# EAGLE design MotionSensorModule (EAGLE 7.7.0)
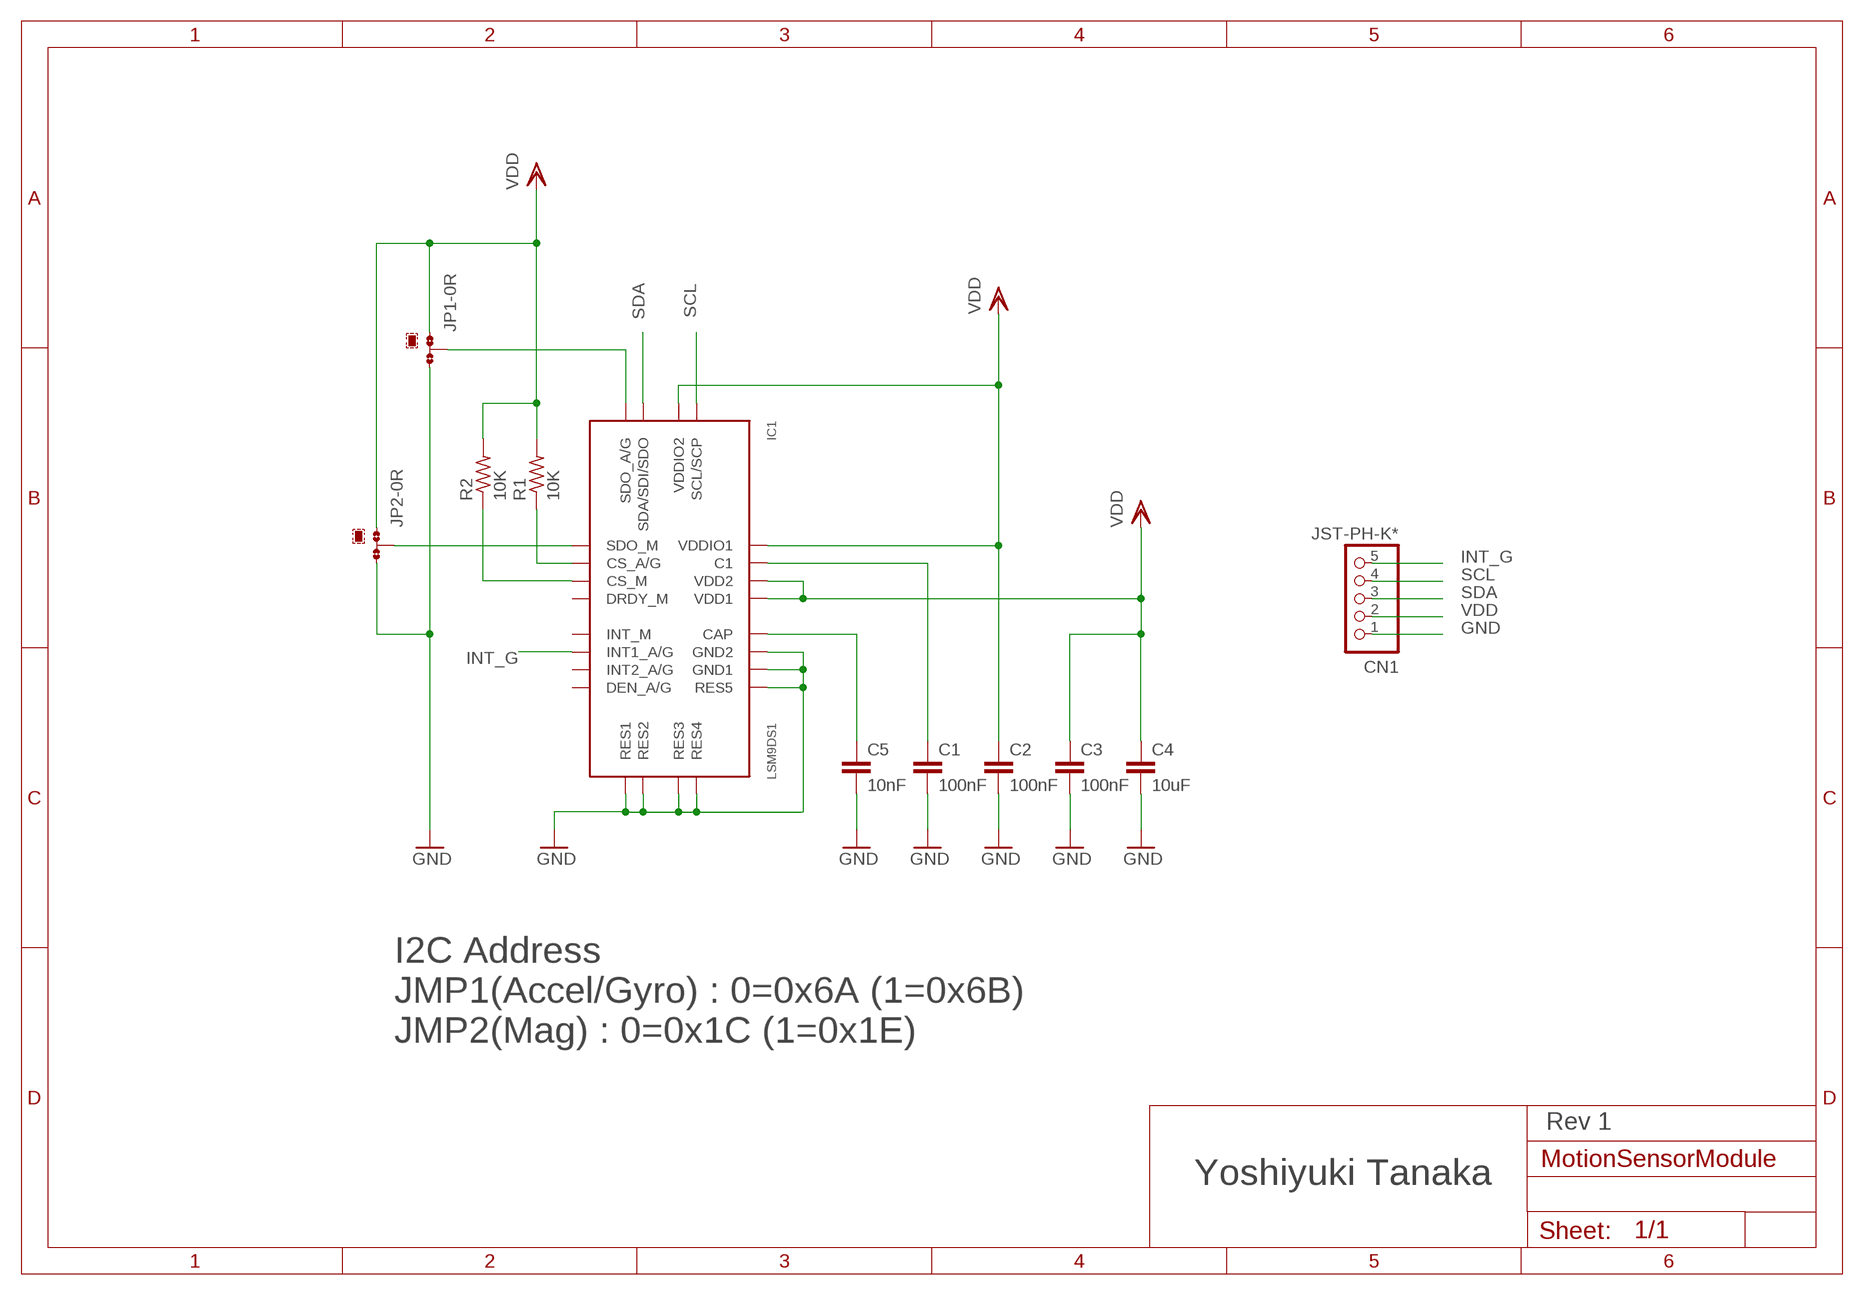
[diagram p0: schematic, sheet 1]

## Parts
C1  100nF  C-EUC0603  [C0603]
C2  100nF  C-EUC0603  [C0603]
C3  100nF  C-EUC0603  [C0603]
C4  10uF  C-EUC0603  [C0603]
C5  10nF  C-EUC0603  [C0603]
CN1  JST-PH-K*  B5B-PH-SM4-TB  [B5B-PH-SM4-TB]
IC1  LSM9DS1  [LGA-24L]
JP1  0R-JUMPB  [B0R-JMP]
JP2  0R-JUMPB  [B0R-JMP]
R1  10K  R-US_R0603  [R0603]
R2  10K  R-US_R0603  [R0603]

## Nets
GND: C1.2 C2.2 C3.2 C4.2 C5.2 CN1.1 IC1.14(RES1) IC1.15(RES2) IC1.16(RES3) IC1.17(RES4) IC1.18(RES5) IC1.19(GND1) IC1.20(GND2) JP1.3 JP2.3
INT_G: CN1.5 IC1.11(INT1_A/G)
N$1: C1.1 IC1.24(C1)
N$2: IC1.8(CS_M) R2.1
N$3: IC1.7(CS_A/G) R1.1
N$4: IC1.5(SDO_A/G) JP1.2
N$6: IC1.6(SDO_M) JP2.2
N$7: C5.1 IC1.21(CAP)
SCL: CN1.4 IC1.2(SCL/SCP)
SDA: CN1.3 IC1.4(SDA/SDI/SDO)
VDD: C2.1 C3.1 C4.1 CN1.2 IC1.1(VDDIO1) IC1.3(VDDIO2) IC1.22(VDD1) IC1.23(VDD2) JP1.1 JP2.1 R1.2 R2.2
Unconnected: IC1.9(DRDY_M) IC1.10(INT_M) IC1.12(INT2_A/G) IC1.13(DEN_A/G)

## Notes on the sheet
- I2C Address
  JMP1(Accel/Gyro) : 0=0x6A (1=0x6B)
  JMP2(Mag) : 0=0x1C (1=0x1E)
- Rev 1
- Yoshiyuki Tanaka

## Library data of the parts
C1-C5 = rcl:C-EU: CAPACITOR, European symbol
CN1 = jst-ph:B5B-PH-*: Wire-to-Board 2.0mm pitch top mount connector Source: http://www.jst-mfg.com/product/pdf/jpn/PH.pdf http://www.jst-mfg.com/product/detail.php?series=199
IC1 = st:LSM9DS1: Mouser 部品番号：511-LSM9DS1TR メーカ部品番号：LSM9DS1TR メーカ:STMicroelectronics 詳細：IMU - 慣性測定ユニット MOTION MEMS CONSUMER
JP1 JP2 = jump-0r-smd:0R-JUMP: SMD 0R 0805 Jumper
R1 R2 = resistor:R-US_: RESISTOR, American symbol

## Board
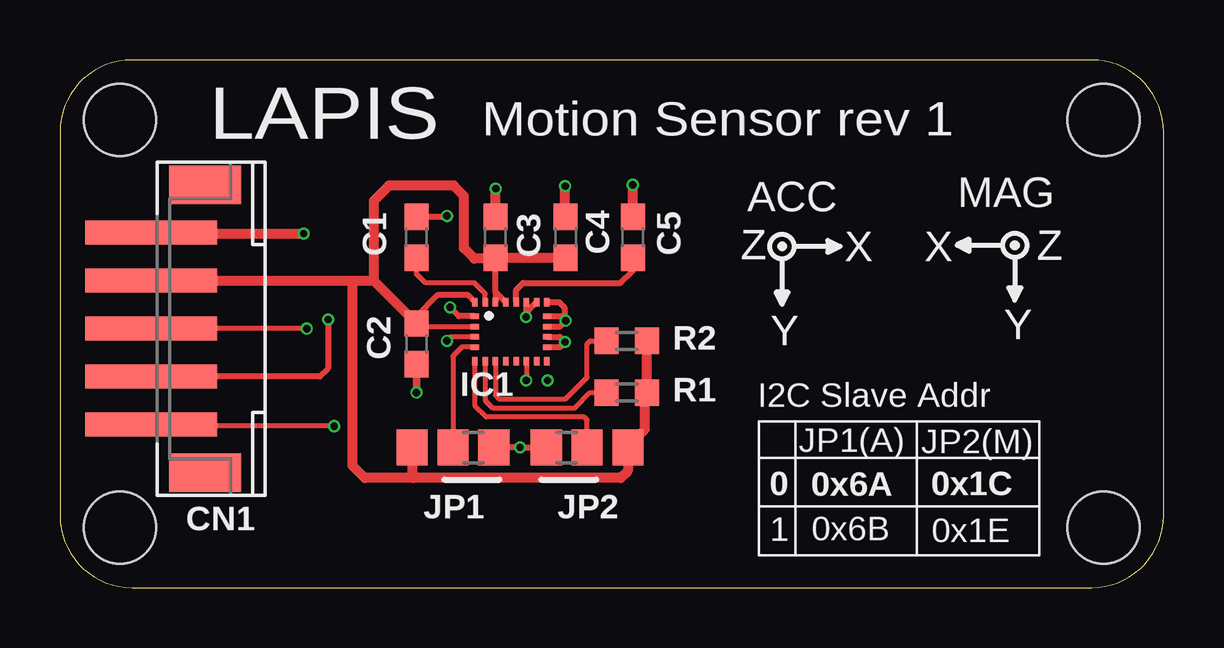
[diagram p1: board, top side]
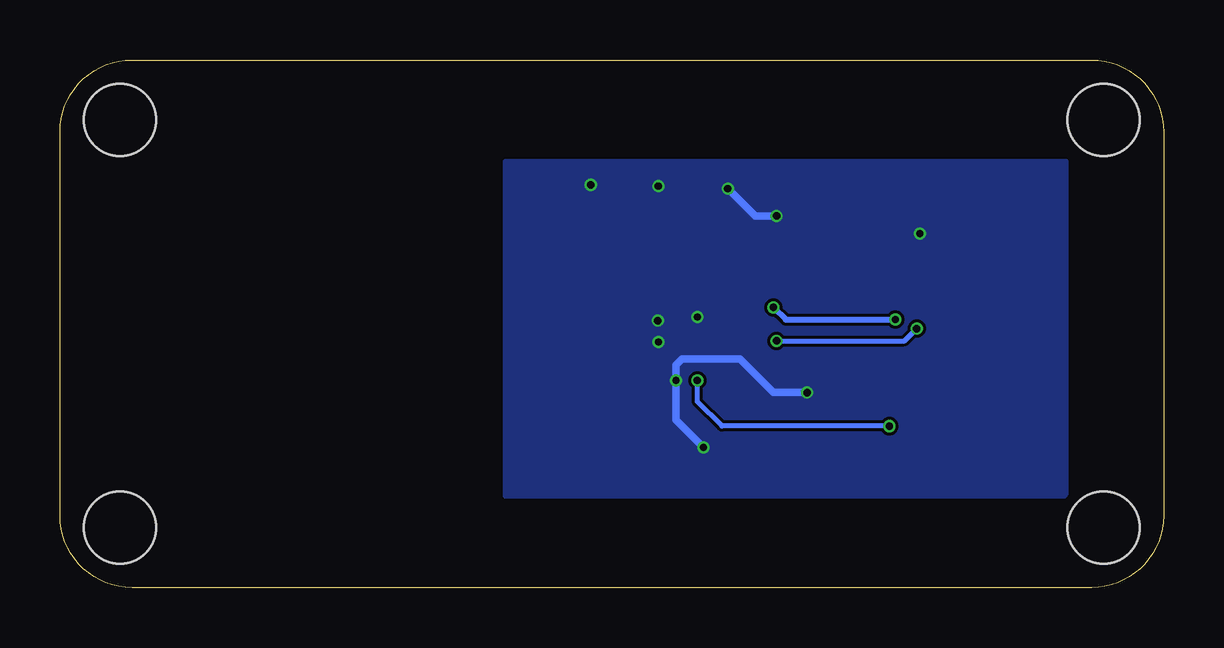
[diagram p2: board, bottom side, seen from below]

Size 46 x 22 mm. Coordinates in mm from the lower left corner, seen from the top.
Outline: 0,3 arc90 3,0 43,0 arc90 46,3 46,19 arc90 43,22 3,22 arc90 0,19 0,3
Copper layers (1*16): Top 0.018mm / dielectric 1.55mm / Bottom 0.018mm
Design rules "unicraft_2layer": minimum track width 0.125mm, minimum drill 0.25mm, track to track 0.125mm, track to pad 0.125mm, pad to pad 0.125mm, via to via 0.125mm, smd to smd 0mil, copper to edge 0.5mm, drill to drill 0.3mm, minimum pad ring 0.175mm, minimum via ring 0.1mm, stop-mask expansion 0mil, vias tented up to drill 0.45mm, thermal gap 0.2mm
Holes 3 mm at 43.5,19.5 2.5,19.5 43.5,2.5 2.5,2.5

### Footprints (pad centres in the part's own frame; a part is rotated, then mirrored left to right if it is on the bottom)
C0603 = smd 1.1 x 1: 1 -0.85,0; 2 0.85,0
B5B-PH-SM4-TB = smd 1 x 5.5: 1 -4,-3.05; 2 -2,-3.05; 3 0,-3.05; 4 2,-3.05; 5 4,-3.05 | smd 1.6 x 3: S1 -6,-0.8; S2 6,-0.8
LGA-24L = smd 0.23 x 0.35: 1 -1.505,1.235; 6 -1.505,-1.235; 7 -1.075,-1.235; 8 -0.645,-1.235; 9 -0.215,-1.235; 10 0.215,-1.235; 11 0.645,-1.235; 12 1.075,-1.235; 13 1.505,-1.235; 18 1.505,1.235; 19 1.075,1.235; 20 0.645,1.235; 21 0.215,1.235; 22 -0.215,1.235; 23 -0.645,1.235; 24 -1.075,1.235 | smd 0.35 x 0.23: 2 -1.505,0.645; 3 -1.505,0.215; 4 -1.505,-0.215; 5 -1.505,-0.645; 14 1.505,-0.645; 15 1.505,-0.215; 16 1.505,0.215; 17 1.505,0.645
B0R-JMP = smd 1.5 x 1.3: 1 0,1.7; 2 0,0; 3 0,-1.7
R0603 = smd 1 x 1.1: 1 -0.85,0; 2 0.85,0

### Placement (x,y rotation side)
C1  14.86,14.61 90 top
C2  14.86,10.16 270 top
C3  18.16,14.61 90 top
C4  21.08,14.61 90 top
C5  23.88,14.61 90 top
CN1  6.86,10.79 270 top
IC1  18.8,10.67 0 top
JP1  16.38,5.84 90 top
JP2  21.97,5.84 270 top
R1  23.62,8.13 0 top
R2  23.62,10.29 0 top

### Tracks (layer width: path | path; a pad name or v marks a point on that pad's centre or on a via)
GND  (via drill 0.3)
  Top 0.254: JP1.3 v19.18,5.84 JP2.3 | v16.13,15.49 16.09,15.46 C1.2 | IC1.20 v19.43,11.28 19.43,11.46 IC1.19 | IC1.17 20.89,11.31 v21.08,11.12 | IC1.16 20.84,10.88 v21.08,11.12 | IC1.15 20.84,10.45 v21.06,10.24 20.84,10.02 IC1.14 | IC1.18 20.81,11.9 21.03,11.68 21.03,11.18 v21.08,11.12 | 5.08,14.73 5.02,14.79 CN1.1
  Top 0.305: C2.2 v14.86,8.13
  Top 0.406: v10.16,14.76 10.13,14.73 5.08,14.73 | C3.2 v18.16,16.64 | C4.2 21.06,15.48 v21.06,16.74 | C5.2 v23.88,16.79
  Bottom 0.305: v16.13,15.49 17.02,15.49 v18.16,16.64 | v19.18,5.84 20.32,6.99 v20.32,8.64 20.32,9.27 20.07,9.53 17.65,9.53 16.26,8.13 v14.86,8.13
  pour Bottom: 4.06,17.78 4.06,3.81 27.43,3.81 27.43,17.78
INT_G  (via drill 0.3)
  Top 0.203: IC1.11 v19.44,8.65 v19.43,8.64 | v11.43,6.73 3.87,6.73 CN1.5
  Bottom 0.203: v11.43,6.73 18.41,6.73 19.43,7.75 v19.43,8.64
N$1
  Top 0.203: C1.1 14.86,13.08 15.24,12.7 17.27,12.7 17.72,12.25 IC1.24
N$2
  Top 0.203: IC1.8 18.15,8.01 18.29,7.87 21.08,7.87 21.97,8.76 21.97,10.16 22.1,10.29 R2.1
N$3
  Top 0.203: IC1.7 17.72,7.81 18.03,7.49 21.46,7.49 22.1,8.13 R1.1
N$4
  Top 0.203: IC1.5 16.75,10.02 16.38,9.65 JP1.2
N$6
  Top 0.203: IC1.6 17.29,7.6 17.78,7.11 21.84,7.11 21.97,6.99 JP2.2
N$7
  Top 0.254: IC1.21 19.01,12.41 19.3,12.7 23.37,12.7 23.88,13.21 C5.1
SCL  (via drill 0.3)
  Top 0.254: IC1.2 16.63,11.31 v16.26,11.68 | v11.18,11.18 11.18,9.14 10.83,8.79 CN1.4
  Bottom 0.254: v16.26,11.68 15.75,11.18 v11.18,11.18
SDA  (via drill 0.3)
  Top 0.203: v10.29,10.79 CN1.3 | IC1.4 16.3,10.45 v16.13,10.29
  Bottom 0.203: v16.13,10.29 10.79,10.29 v10.29,10.79
VDD
  Top 0.203: C2.1 14.99,10.88 IC1.3
  Top 0.254: IC1.1 17,12.19 15.75,12.19 14.86,11.3 C2.1 | C3.1 18.15,13.74 18.15,12.33 | 18.15,12.33 IC1.23 | IC1.22 18.15,12.33
  Top 0.406: CN1.2 12.19,12.79 | 12.19,12.79 13.07,12.79 | 13.07,12.79 C2.1 | JP1.1 14.68,4.62 14.73,4.57 | 14.73,4.57 12.7,4.57 12.19,5.08 12.19,12.79 | 14.73,4.57 23.37,4.57 23.67,4.88 JP2.1 23.67,5.89 24.38,6.6 24.38,8.04 R1.2 R2.2 | 13.07,12.79 13.07,16.12 13.72,16.76 16.41,16.76 16.84,16.33 16.84,14.15 17.27,13.72 18.12,13.72 C3.1 C4.1

### Text on the board
tPlace: LAPIS | Motion Sensor rev 1 | ACC | MAG | Z | X | X | Z | Y | Y | I2C Slave Addr | JP1(A) | JP2(M) | 0 | 0x6A | 0x1C | 1 | 0x6B | 0x1E